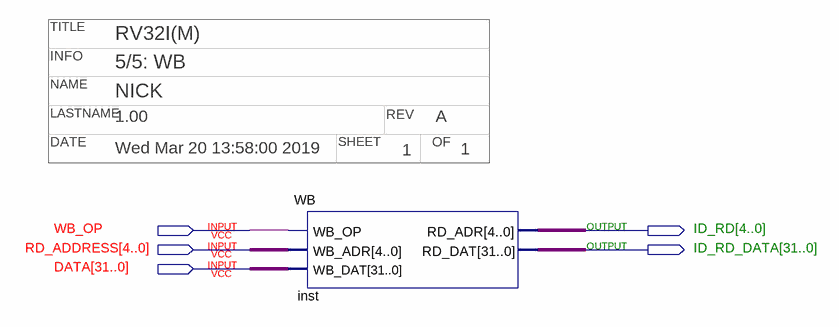
[diagram p0: schematic sheet]
// Quartus schematic WBTEST.bdf as structural Verilog: 1 symbols, 5 pins
// Title block: TITLE: RV32I(M); INFO: 5/5: WB; NAME: NICK; LASTNAME: 1.00; REV: A; DATE: Wed Mar 20 13:58:00 2019; SHEET: 1; OF: 1
module WBTEST (
  input  WB_OP,
  input  [4:0] RD_ADDRESS,
  input  [31:0] DATA,
  output [4:0] ID_RD,
  output [31:0] ID_RD_DATA
);

  WB inst (.WB_OP(WB_OP), .WB_ADR(RD_ADDRESS), .WB_DAT(DATA), .RD_ADR(ID_RD), .RD_DAT(ID_RD_DATA));
endmodule
